# EAGLE design RF_ant_board (EAGLE 9.3.0)
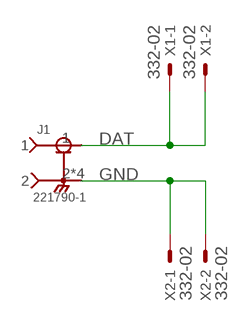
[diagram p0: schematic, sheet 1]

## Parts
J1  221790-1  [TE_221790-1]
X1  332-02  [332-02]
X2  332-02  [332-02]

## Nets
DAT: J1.1 X1.1 X1.2
GND: J1.2 J1.3 J1.4 J1.5 X2.1 X2.2

## Library data of the parts
J1 = 221790-1:221790-1: Connector; SMA; PCB; Right Angle; Stainless Steel; 0.6 in.; Beryllium Copper; AVAILABILITY: Unavailable; COMMENT: 221790-1; DESCRIPTION: JACK,RIGHT ANGLE,PCB,SMA; EU_ROHS_COMPLIANCE: Compliant with Exemptions; MF: TE Connectivity; MP: 221790-1; NUMBER_OF_POSITIONS: 1; PACKAGE: None; PRICE: None; TE_PURCHASE_URL: https://www.te.com/usa-en/product-221790-1.html?te_bu=Cor&te_type=disp&te_campaign=seda_glo_cor-seda-global-disp-prtnr-fy19-seda-model-bom-cta_sma-317_1&elqCampaignId=32493
X1 X2 = con-garry:332-02: 2 Pin - 2mm Dual Row Source: www.mpe-connector.de / garry_shortform_2012.pdf

## Board
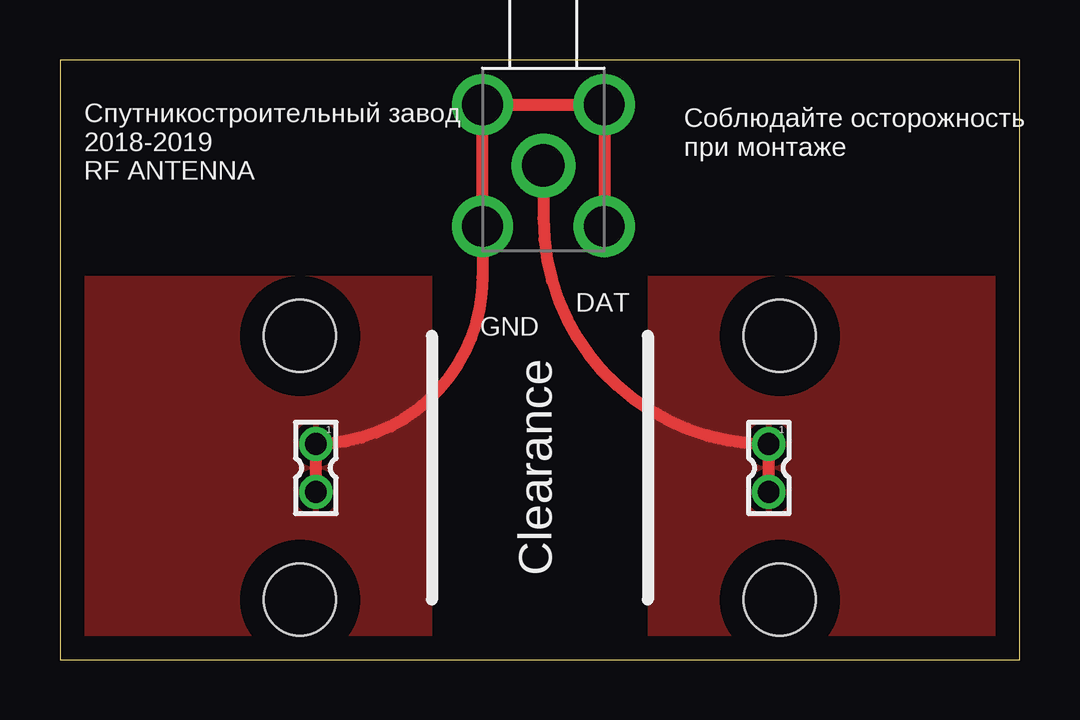
[diagram p1: board, top side]

Size 40 x 25 mm. Coordinates in mm from the lower left corner, seen from the top.
Outline: 0,0 40,0 40,25 0,25 0,0
Copper layers (1*16): Top 0.035mm / dielectric 1mm / Bottom 0.035mm
Design rules "rezonit": minimum track width 0.2mm, minimum drill 0.5mm, track to track 0.25mm, track to pad 0.25mm, pad to pad 0.25mm, via to via 0.25mm, smd to smd 0.2mm, copper to edge 0.4mm, drill to drill 0.4mm, minimum pad ring 0.25mm, minimum via ring 0.25mm, stop-mask expansion 4mil, vias tented up to drill 0.6mm, thermal gap 10mil
Holes 3 mm at 10,2.5 10,13.5 30,2.5 30,13.5

### Footprints (pad centres in the part's own frame; a part is rotated, then mirrored left to right if it is on the bottom)
TE_221790-1 = drill 1.778: 1 0,0 | drill 1.702: 2 -2.54,2.54; 3 2.54,2.54; 4 -2.54,-2.54; 5 2.54,-2.54
332-02 = drill 0.9 pad 1.27: 1 0,-1; 2 0,1

### Placement (x,y rotation side)
J1  20.15,20.6 90 top
X1  29.55,7.99 180 top
X2  10.67,7.99 180 top

### Tracks (layer width: path | path; a pad name or v marks a point on that pad's centre or on a via)
DAT
  Top 0.5: J1.1 20.15,18.39 arc90 X1.1 X1.2
  pour Top (isolate 1): 40,16 40,0 24.5,0 24.5,16
GND
  Top 0.5: J1.4 J1.5 J1.3 J1.2 17.61,15.93 arc-90 X2.1 X2.2
  pour Top (isolate 1): 0,16 0,0 15.5,0 15.5,16

### Text on the board
tPlace: Соблюдайте осторожность / при монтаже | Спутникостроительный завод / 2018-2019 / RF ANTENNA | GND | DAT | Clearance